# EasyEDA schematic SCH_Hiking-Alarm-Trail_2024-05-05.json
TITLE: Sheet_1; REV: 1.0; Date: 2024-05-04; Sheet: 1/1; Drawn By: staticsahib30241; Company: Your Company
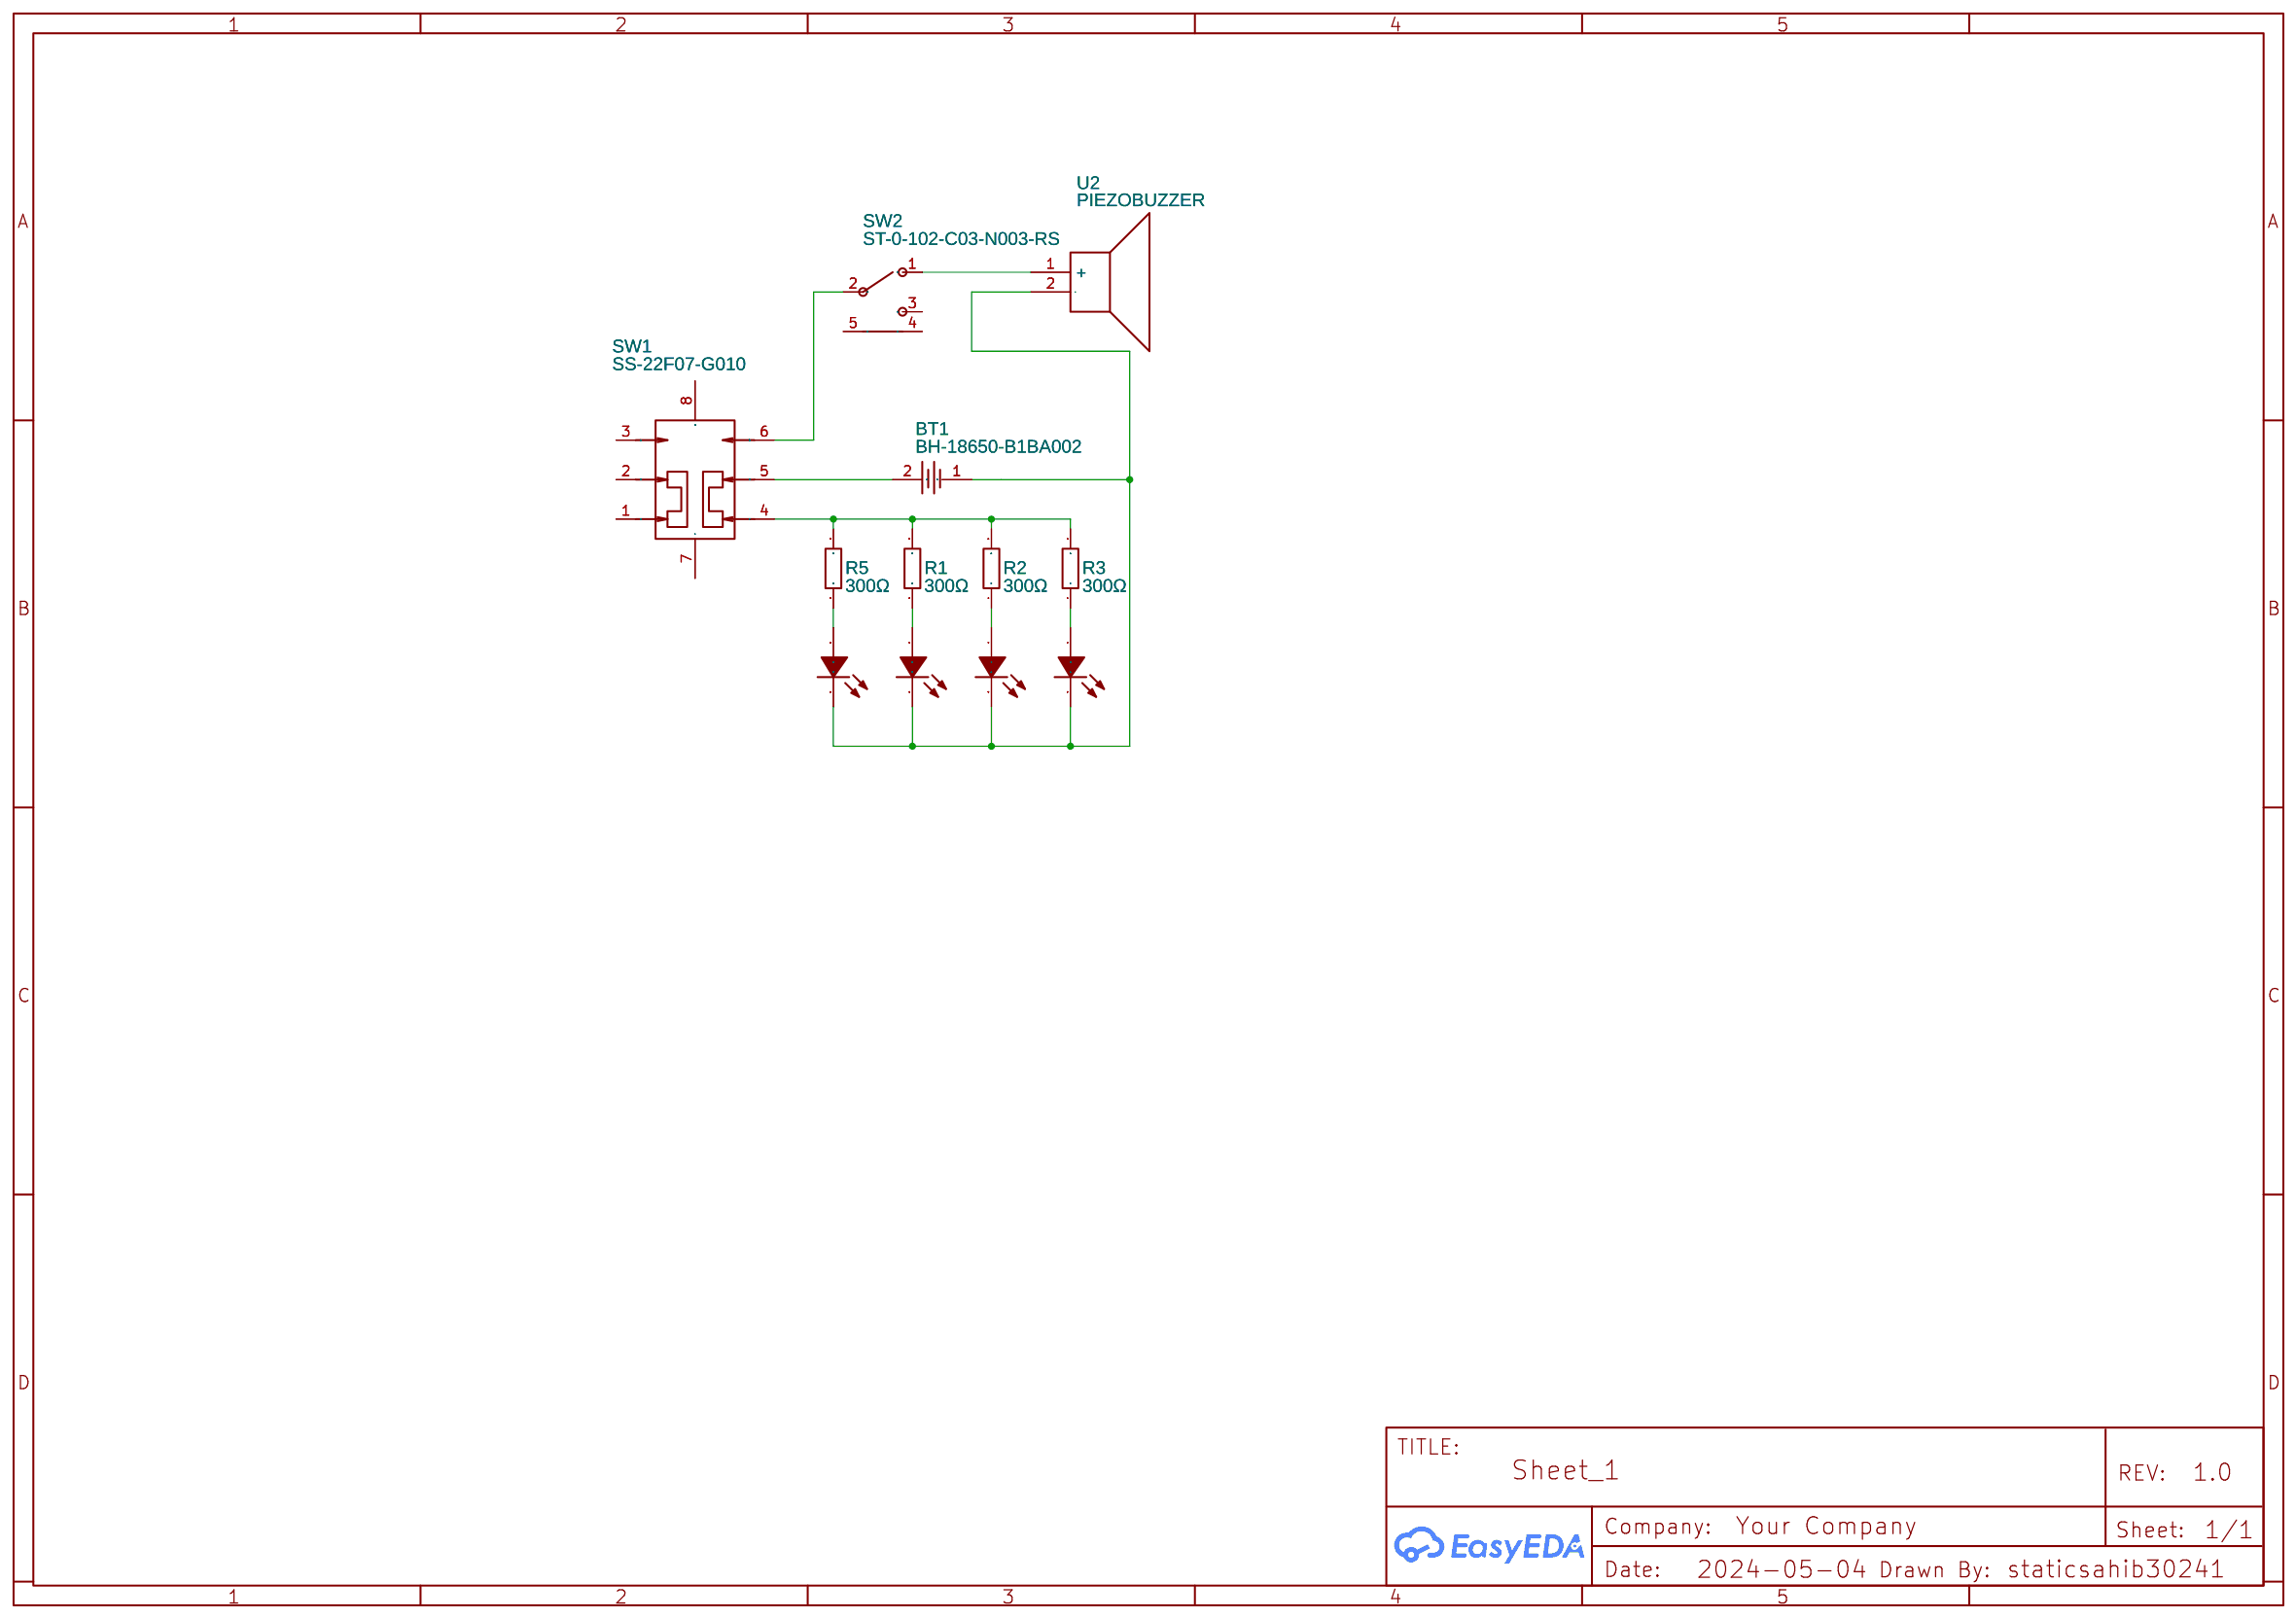
[diagram p0: schematic sheet]

## Parts
BT1  BH-18650-B1BA002  [BATTERY-SMD_18650-1S-L77.1-W20.7-1]
LED1  19-21SURC/S530-A5/TR8  [LED0603-R-RD_RED]
LED2  19-21SURC/S530-A5/TR8  [LED0603-R-RD_RED]
LED3  19-21SURC/S530-A5/TR8  [LED0603-R-RD_RED]
LED4  19-21SURC/S530-A5/TR8  [LED0603-R-RD_RED]
R1  300Ω  [R0805]
R2  300Ω  [R0805]
R3  300Ω  [R0805]
R5  300Ω  [R0805]
SW1  SS-22F07-G010  [SW-TH_6P-L16.5-W7.5-P4.0-LS2.6-TL]
SW2  ST-0-102-C03-N003-RS  [SW-TH_ST-0-102-C03-N003-RS]
U2  PIEZOBUZZER  [PIEZOBUZZER]

## Library data of the parts
BT1 = BH-18650-B1BA002: Contributor: lcsc; Supplier: LCSC; Supplier Part: C2988620; Manufacturer: MYOUNG(美阳); JLCPCB Part Class: Extended Part
LED1-LED4 = 19-21SURC/S530-A5/TR8: Contributor: LCSC; Supplier: LCSC; Supplier Part: C131269; Manufacturer: EVERLIGHT(亿光); JLCPCB Part Class: Extended Part
R1-R3 R5 = 0805W8F3000T5E: Supplier: LCSC; Manufacturer: UNI-ROYAL(厚声); Supplier Part: C17617; JLCPCB Part Class: Basic Part
SW1 = SS-22F07-G010: Contributor: LCSC; Supplier: LCSC; Supplier Part: C2848924; Manufacturer: G-Switch(品赞); JLCPCB Part Class: Extended Part
SW2 = ST-0-102-C03-N003-RS: Contributor: LCSC; Supplier: LCSC; Supplier Part: C1788489; Manufacturer: YUEN FUNG(源丰); JLCPCB Part Class: Extended Part
U2 = PIEZOBUZZER: Contributor: levachu; sourceId: mCAavtrNL

## Nets
Net-(BT1-1): BT1.1 LED1.2(C) LED2.2(C) LED3.2(C) LED4.2(C) U2.2(-)
Net-(BT1-2): BT1.2 SW1.5
Net-(LED1-1): LED1.1(A) R5.1
Net-(LED2-1): LED2.1(A) R1.1
Net-(LED3-1): LED3.1(A) R2.1
Net-(LED4-1): LED4.1(A) R3.1
Net-(R1-2): R1.2 R2.2 R3.2 R5.2 SW1.4
Net-(SW1-6): SW1.6 SW2.2
Net-(SW2-1): SW2.1 U2.1(+)

Not connected (* = marked no-connect by the designer): SW1 1 2 3 7 8; SW2 3 4 5
